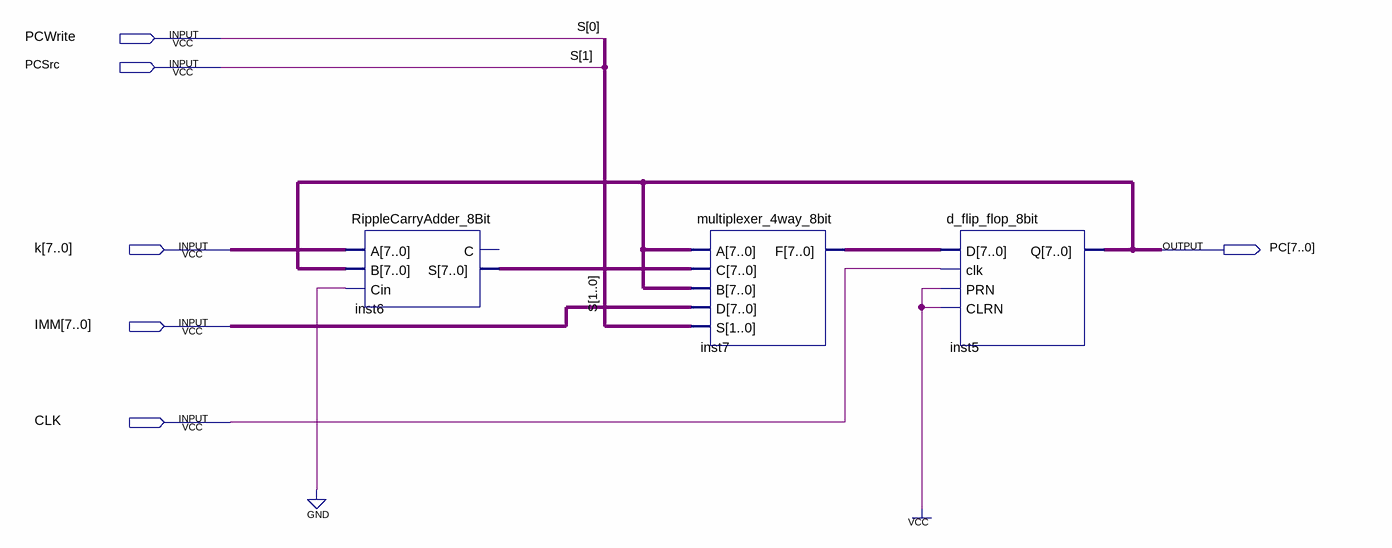
[diagram p0: schematic sheet]
// Quartus schematic program_counter_8bit.bdf as structural Verilog: 3 symbols, 6 pins
module program_counter_8bit (
  input  PCWrite,
  input  PCSrc,
  input  [7:0] k,
  input  [7:0] IMM,
  input  CLK,
  output [7:0] PC
);

  wire [7:0] inst6_s, inst7_f;

  RippleCarryAdder_8Bit inst6 (.A(k), .B(PC), .Cin(1'b0), .S(inst6_s));  // open: C
  multiplexer_4way_8bit inst7 (.A(PC), .C(inst6_s), .B(PC), .D(IMM), .S({PCSrc, PCWrite}), .F(inst7_f));
  d_flip_flop_8bit inst5 (.D(inst7_f), .clk(CLK), .PRN(1'b1), .CLRN(1'b1), .Q(PC));

  // Other names for the same wires on the sheet: S[1:0] = {PCSrc, PCWrite}
endmodule
